# EAGLE design 2020_IST_Respirator_v1.1 (EAGLE 7.7.0)
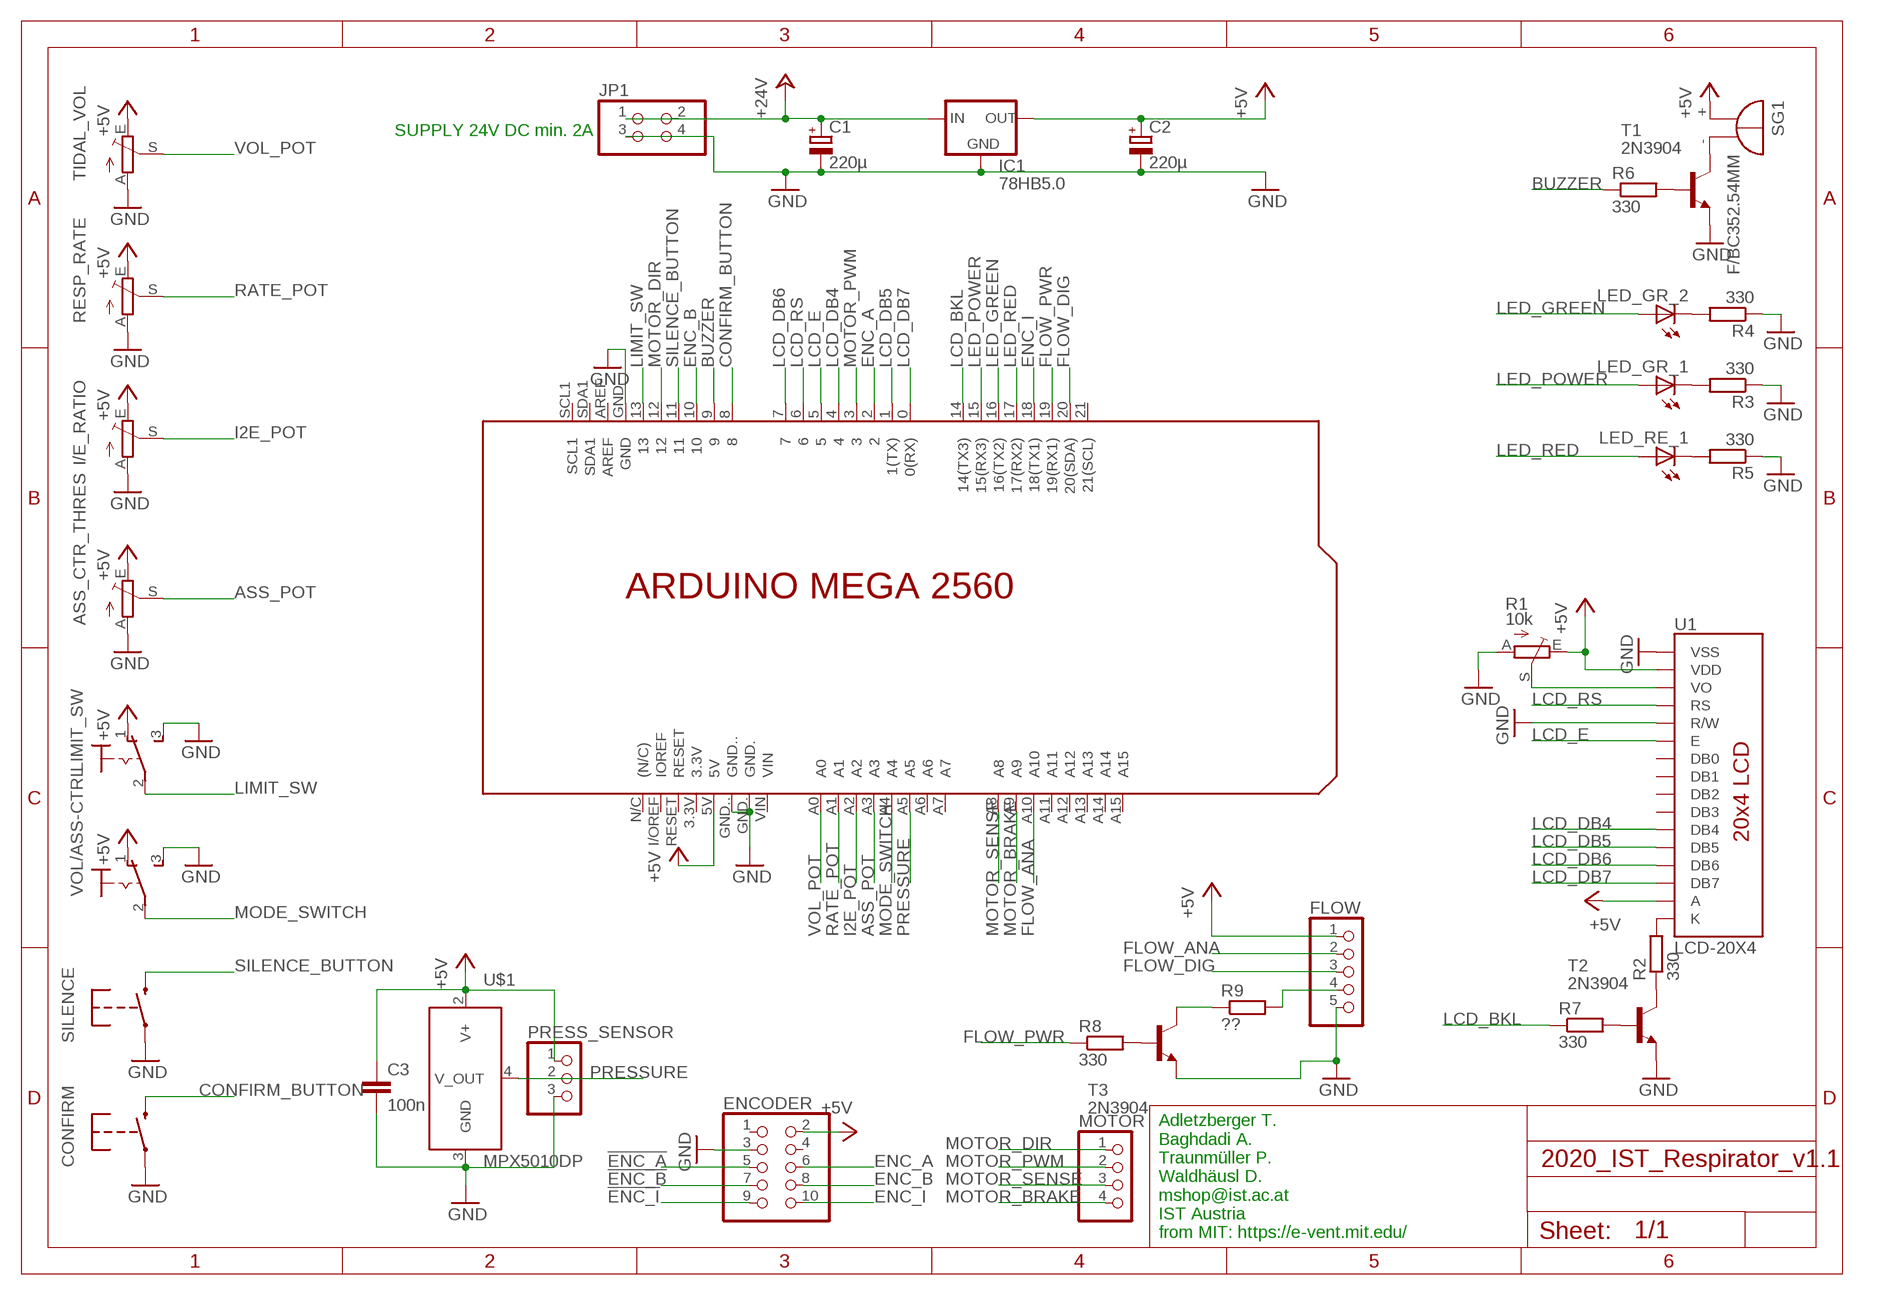
[diagram p0: schematic, sheet 1]

## Parts
ASS_CTR_THRES  TRIM_EU-S64W  [S64W]
C1  220µ  CPOL-EUE5-10.5  [E5-10,5]
C2  220µ  CPOL-EUE5-10.5  [E5-10,5]
C3  100n  C-EUC0805  [C0805]
CONFIRM  SWITCH-MOMENTARY-22.54  [TACTILE-2.54MM]
ENCODER  PINHD-2X5  [2X05]
FLOW  PINHD-1X5  [1X05]
I/E_RATIO  TRIM_EU-S64W  [S64W]
IC1  78HB5.0  78XXS  [78XXS]
JP1  PINHD-2X2  [2X02]
LED_GR_1  LED5MM  [LED5MM]
LED_GR_2  LED5MM  [LED5MM]
LED_RE_1  LED5MM  [LED5MM]
LIMIT_SW  320-9162.54MM  [320-916:2.54MM]
MOTOR  PINHD-1X4  [1X04]
PCB1  ARDUINO_MEGA2560_NOTALLPINS  [ARDUINO_MEGA2560_NOTALLPINS]
PRESS_SENSOR  PINHD-1X3  [1X03]
R1  10k  TRIM_EU-S64W  [S64W]
R2  330  R-EU_0207/10  [0207/10]
R3  330  R-EU_0207/10  [0207/10]
R4  330  R-EU_0207/10  [0207/10]
R5  330  R-EU_0207/10  [0207/10]
R6  330  R-EU_0207/10  [0207/10]
R7  330  R-EU_0207/10  [0207/10]
R8  330  R-EU_0207/10  [0207/10]
R9  ??  R-EU_0207/10  [0207/10]
RESP_RATE  TRIM_EU-S64W  [S64W]
SG1  F/BC352.54MM  [F/BC35_2.54MM]
SILENCE  SWITCH-MOMENTARY-22.54  [TACTILE-2.54MM]
T1  2N3904  [TO92]
T2  2N3904  [TO92]
T3  2N3904  [TO92]
TIDAL_VOL  TRIM_EU-S64W  [S64W]
U1  LCD-20X4  [LCD-20X4]
U$1  MPX5010DP  [MPX5010DP_SOP482]
VOL/ASS-CTRL  320-9162.54MM  [320-916:2.54MM]

## Nets
!ENC_A: ENCODER.5
!ENC_B: ENCODER.7
!ENC_I: ENCODER.9
+5V: ASS_CTR_THRES.E C2.+ C3.1 ENCODER.2 FLOW.1 I/E_RATIO.E IC1.OUT LIMIT_SW.1(O) PCB1.5V PRESS_SENSOR.1 R1.E RESP_RATE.E SG1.+ TIDAL_VOL.E U1.2(VDD) U1.15(A) U$1.2(V+) VOL/ASS-CTRL.1(O)
+24V: C1.+ IC1.IN JP1.1 JP1.2
ASS_POT: ASS_CTR_THRES.S PCB1.A3
BUZZER: PCB1.9 R6.1
CONFIRM_BUTTON: CONFIRM.3 PCB1.8
ENC_A: ENCODER.6 PCB1.2
ENC_B: ENCODER.8 PCB1.10
ENC_I: ENCODER.10 PCB1.18(18(TX1))
FLOW_ANA: FLOW.2 PCB1.A10
FLOW_DIG: FLOW.3 PCB1.20(20(SDA))
FLOW_PWR: PCB1.19(19(RX1)) R8.1
GND: ASS_CTR_THRES.A C1.- C2.- C3.2 CONFIRM.1 ENCODER.3 FLOW.5 I/E_RATIO.A IC1.GND JP1.3 JP1.4 LIMIT_SW.3(S) PCB1.GND PCB1.GND. PCB1.GND.. PRESS_SENSOR.3 R1.A R3.1 R4.1 R5.1 RESP_RATE.A SILENCE.1 T1.3(E) T2.3(E) T3.3(E) TIDAL_VOL.A U1.1(VSS) U1.5(R/W) U$1.3(GND) VOL/ASS-CTRL.3(S)
I2E_POT: I/E_RATIO.S PCB1.A2
LCD_BKL: PCB1.14(14(TX3)) R7.1
LCD_DB4: PCB1.4 U1.11(DB4)
LCD_DB5: PCB1.1(1(TX)) U1.12(DB5)
LCD_DB6: PCB1.7 U1.13(DB6)
LCD_DB7: PCB1.0(0(RX)) U1.14(DB7)
LCD_E: PCB1.5 U1.6(E)
LCD_RS: PCB1.6 U1.4(RS)
LED_GREEN: LED_GR_2.A PCB1.16(16(TX2))
LED_POWER: LED_GR_1.A PCB1.15(15(RX3))
LED_RED: LED_RE_1.A PCB1.17(17(RX2))
LIMIT_SW: LIMIT_SW.2(P) PCB1.13
MODE_SWITCH: PCB1.A4 VOL/ASS-CTRL.2(P)
MOTOR_BRAKE: MOTOR.4 PCB1.A9
MOTOR_DIR: MOTOR.1 PCB1.12
MOTOR_PWM: MOTOR.2 PCB1.3
MOTOR_SENSE: MOTOR.3 PCB1.A8
N$1: R8.2 T3.2(B)
N$2: R9.1 T3.1(C)
N$3: FLOW.4 R9.2
N$9: SG1.- T1.1(C)
N$10: R6.2 T1.2(B)
N$34: R2.2 U1.16(K)
N$35: R2.1 T2.1(C)
N$36: R7.2 T2.2(B)
N$37: R1.S U1.3(VO)
N$38: LED_GR_2.K(C) R4.2
N$39: LED_GR_1.K(C) R3.2
N$40: LED_RE_1.K(C) R5.2
PRESSURE: PCB1.A5 PRESS_SENSOR.2 U$1.4(V_OUT)
RATE_POT: PCB1.A1 RESP_RATE.S
SILENCE_BUTTON: PCB1.11 SILENCE.3
VOL_POT: PCB1.A0 TIDAL_VOL.S
Unconnected: ENCODER.1 ENCODER.4 PCB1.3.3V PCB1.21(21(SCL)) PCB1.A6 PCB1.A7 PCB1.A11 PCB1.A12 PCB1.A13 PCB1.A14 PCB1.A15 PCB1.AREF PCB1.I/OREF(IOREF) PCB1.N/C((N/C)) PCB1.RESET PCB1.SCL1 PCB1.SDA1 PCB1.VIN U1.7(DB0) U1.8(DB1) U1.9(DB2) U1.10(DB3)

## Notes on the sheet
- SUPPLY 24V DC min. 2A
- Adletzberger T.
  Baghdadi A.
  Traunmüller P.
  Waldhäusl D.
  mshop@ist.ac.at
  IST Austria 
  from MIT: https://e-vent.mit.edu/

## Library data of the parts
ASS_CTR_THRES I/E_RATIO R1 RESP_RATE TIDAL_VOL = pot:TRIM_EU-: POTENTIOMETER
C1 C2 = rcl:CPOL-EU: POLARIZED CAPACITOR, European symbol
C3 = rcl:C-EU: CAPACITOR, European symbol
CONFIRM SILENCE = SparkFun:SWITCH-MOMENTARY-2
ENCODER = pinhead:PINHD-2X5: PIN HEADER
FLOW = pinhead:PINHD-1X5: PIN HEADER
IC1 = v-reg:78XXS: VOLTAGE REGULATOR
JP1 = pinhead:PINHD-2X2: PIN HEADER
LED_GR_1 LED_GR_2 LED_RE_1 = led:LED: LED OSRAM: - CHIPLED LG R971, LG N971, LY N971, LG Q971, LY Q971, LO R971, LY R971 LH N974, LH R974 LS Q976, LO Q976, LY Q976 LO Q996 - Hyper CHIPLED LW Q18S LB Q993, LB Q99A, LB R99A - SideLED LS A670, LO A670, LY A670, LG A670, LP A670 LB A673, LV A673, LT A673, LW A673 LH A674 LY A675 LS A676, LA A676, LO A676, LY A676, LW A676 LS A679, LY A679, LG A679 - Hyper Micro SIDELED® LS Y876, LA Y876, LO Y876, LY Y876 LT Y87S - SmartLED LW L88C, LW L88S LB L89C, LB L89S, LG L890 LS L89K, LO L89K, LY L89K LS L896, LA L896, LO L896, LY L896 - TOPLED LS T670, LO T670, LY T670, LG T670, LP T670 LSG T670, LSP T670, LSY T670, LOP T670, LYG T670 LG T671, LOG T671, LSG T671 LB T673, LV T673, LT T673, LW T673 LH T674 LS T676, LA T676, LO T676, LY T676, LB T676, LH T676, LSB T676, LW T676 LB T67C, LV T67C, LT T67C, LS T67K, LO T67K, LY T67K, LW E67C LS E67B, LA E67B, LO E67B, LY E67B, LB E67C, LV E67C, LT E67C LW T67C LS T679, LY T679, LG T679 LS T770, LO T770, LY T770, LG T770, LP T770 LB T773, LV T773, LT T773, LW T773 LH T774 LS E675, LA E675, LY E675, LS T675 LS T776, LA T776, LO T776, LY T776, LB T776 LHGB T686 LT T68C, LB T68C - Hyper Mini TOPLED® LB M676 - Mini TOPLED Santana® LG M470 LS M47K, LO M47K, LY M47K Source: http://www.osram.convergy.de LUXEON: - LUMILED® LXK2-PW12-R00, LXK2-PW12-S00, LXK2-PW14-U00, LXK2-PW14-V00 LXK2-PM12-R00, LXK2-PM12-S00, LXK2-PM14-U00 LXK2-PE12-Q00, LXK2-PE12-R00, LXK2-PE12-S00, LXK2-PE14-T00, LXK2-PE14-U00 LXK2-PB12-K00, LXK2-PB12-L00, LXK2-PB12-M00, LXK2-PB14-N00, LXK2-PB14-P00, LXK2-PB14-Q00 LXK2-PR12-L00, LXK2-PR12-M00, LXK2-PR14-Q00, LXK2-PR14-R00 LXK2-PD12-Q00, LXK2-PD12-R00, LXK2-PD12-S00 LXK2-PH12-R00, LXK2-PH12-S00 LXK2-PL12-P00, LXK2-PL12-Q00, LXK2-PL12-R00 Source: www.luxeon.com KINGBRIGHT: KA-3528ASYC Source: www.kingbright.com
LIMIT_SW VOL/ASS-CTRL = switch:320-916: TOGGLE SWITCH distributor RS Components
MOTOR = pinhead:PINHD-1X4: PIN HEADER
PCB1 = E14_Arduino_revB:ARDUINO_MEGA2560_NOTALLPINS: Device for representing an Arduino Mega 2560 board with a footprint in an EAGLE design. Created by Dave Young for Element14. More EAGLE documentation at: http://www.element14.com/community/community/knode/cadsoft_eagle
PRESS_SENSOR = pinhead:PINHD-1X3: PIN HEADER
R2-R9 = rcl:R-EU_: RESISTOR, European symbol
SG1 = buzzer:F/BC35: BUZZER Source: Spoerle
T1-T3 = transistor:2N3904: NPN TRANSISTOR
U1 = SparkFun:LCD-20X4
U$1 = SparkFun:MPX5010DP: MPX5010 Pressure Sensor Differential/Gauge Pressure Sensors up to 10 kPa, NXP MEMS-based low-pressure differential/gauge sensors measure the difference in pressure between sources when pressure is applied to both sides of the sensor (differential) and atmospheric pressure (gauged). Pressure Sensors, NXP RS Stock No. 922-7409 Mfr. Part No. MPXV5010DP

## Board
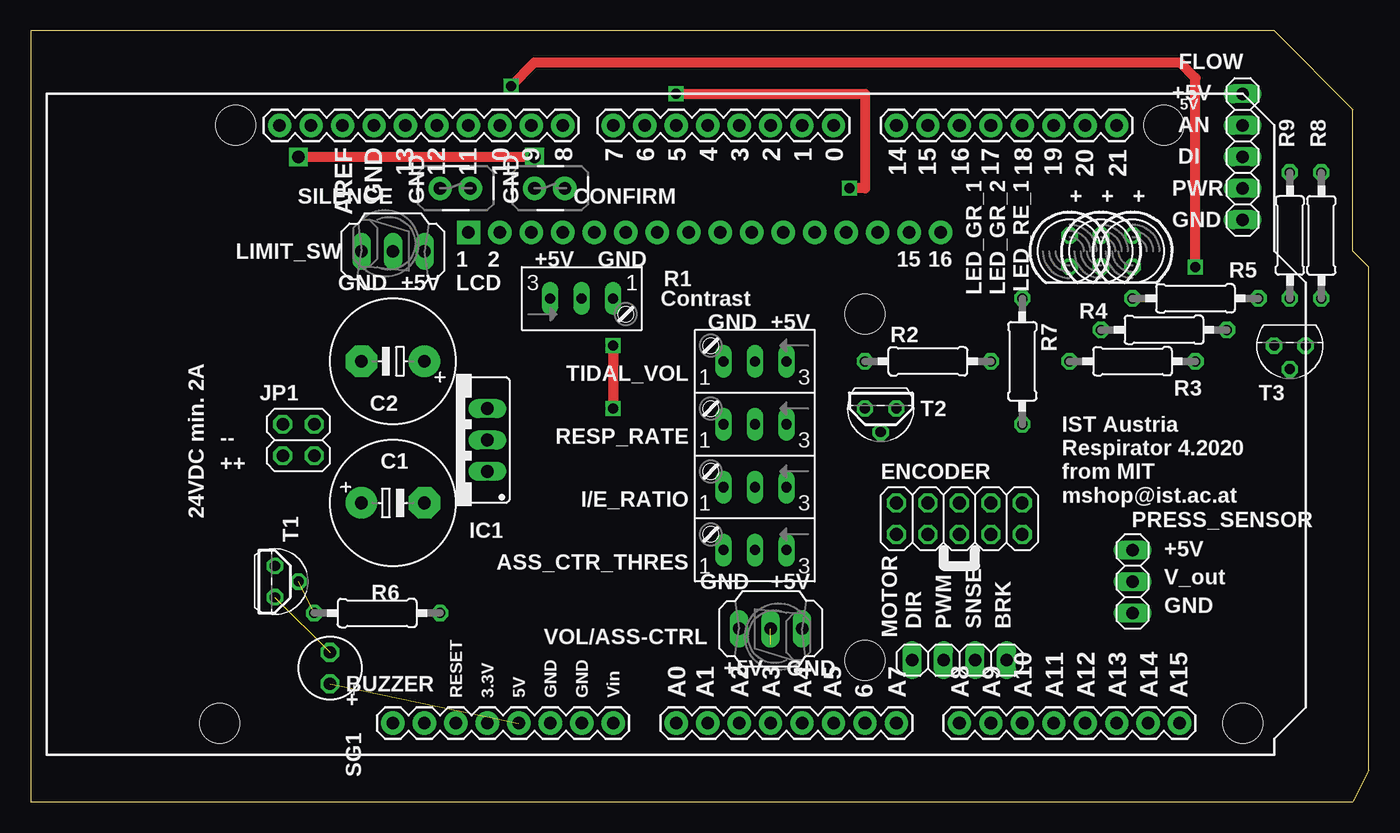
[diagram p1: board, top side]
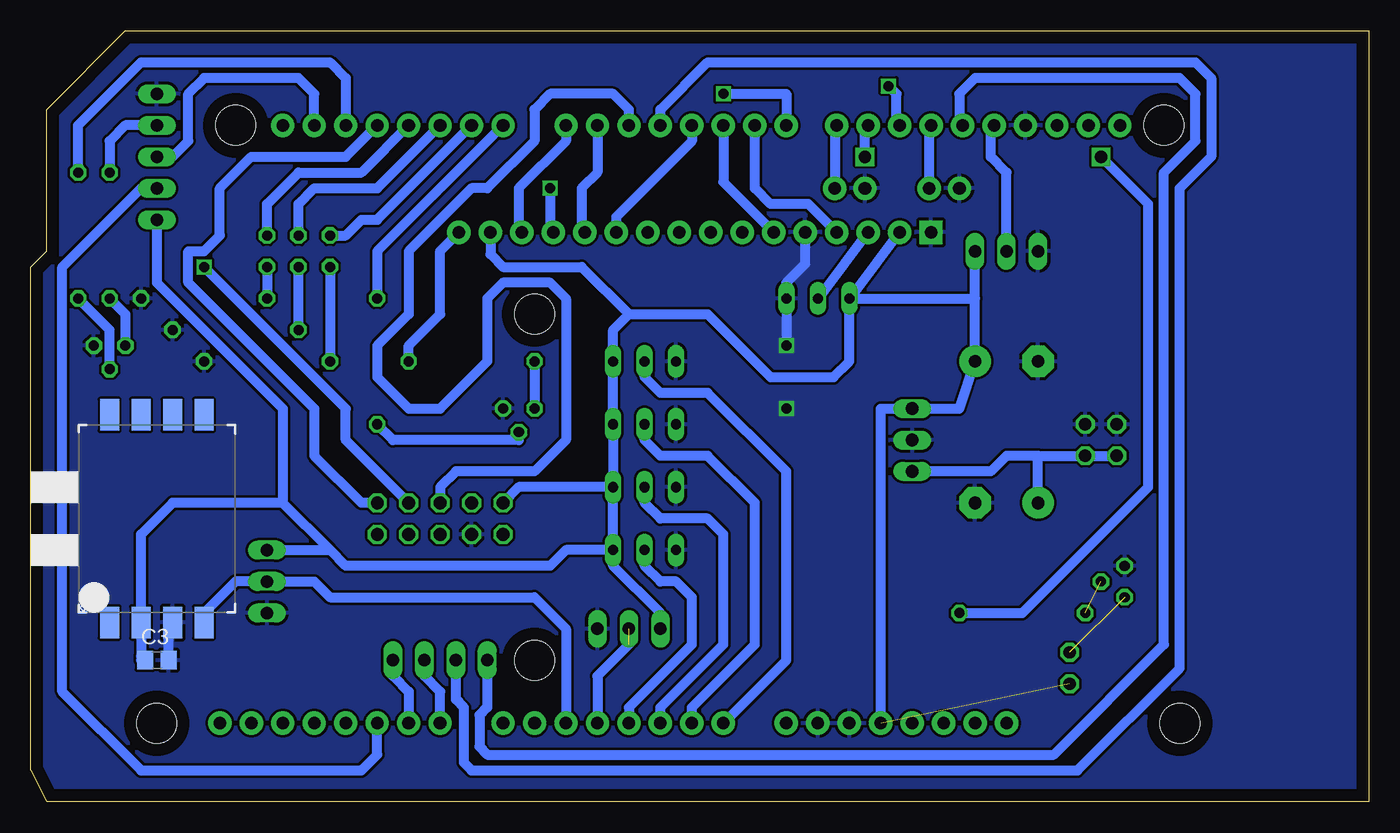
[diagram p2: board, bottom side, seen from below]

Size 107.95 x 62.23 mm. Coordinates in mm from the lower left corner, seen from the top.
Outline: 0,0 106.68,0 107.95,2.54 107.95,43.18 106.68,44.45 106.68,55.88 100.33,62.23 0,62.23 0,0
Copper layers (1*16): Top 0.035mm / dielectric 1.5mm / Bottom 0.035mm
Design rules "default": minimum track width 10mil, minimum drill 24mil, track to track 8mil, track to pad 8mil, pad to pad 8mil, via to via 8mil, smd to smd 8mil, copper to edge 40mil, drill to drill 8mil, minimum pad ring 10mil, minimum via ring 8mil, stop-mask expansion 4mil, vias tented up to drill 0mil, thermal gap 10mil

### Footprints (pad centres in the part's own frame; a part is rotated, then mirrored left to right if it is on the bottom)
S64W = drill 0.813 long: A 2.54,1.27; E -2.54,1.27; S 0,1.27
E5-10,5 = drill 1.016 pad 2.54: + -2.54,0 | drill 1.016 pad 2.54 octagon: - 2.54,0
C0805 = smd 1.3 x 1.5: 1 -0.95,0; 2 0.95,0
TACTILE-2.54MM = drill 1.016 pad 1.88: 1 0,1.27; 3 0,-1.17
2X05 = drill 1.016 octagon: 1 -5.08,-1.27; 2 -5.08,1.27; 3 -2.54,-1.27; 4 -2.54,1.27; 5 0,-1.27; 6 0,1.27; 7 2.54,-1.27; 8 2.54,1.27; 9 5.08,-1.27; 10 5.08,1.27
1X05 = drill 1.016 long: 1 -5.08,0; 2 -2.54,0; 3 0,0; 4 2.54,0; 5 5.08,0
78XXS = drill 1.016 long: GND 0,-2.54; IN -2.54,-2.54; OUT 2.54,-2.54
2X02 = drill 1.016 octagon: 1 -1.27,-1.27; 2 -1.27,1.27; 3 1.27,-1.27; 4 1.27,1.27
LED5MM = drill 0.813 octagon: A -1.27,0; K 1.27,0
320-916:2.54MM = drill 1 long: 1 0,2.54; 2 0,0; 3 0,-2.54
1X04 = drill 1.016 long: 1 -3.81,0; 2 -1.27,0; 3 1.27,0; 4 3.81,0
ARDUINO_MEGA2560_NOTALLPINS = drill 1.016 pad 1.88: 0 63.5,50.8; 1 60.96,50.8; 2 58.42,50.8; 3 55.88,50.8; 3.3V 35.56,2.54; 4 53.34,50.8; 5 50.8,50.8; 5V 38.1,2.54; 6 48.26,50.8; 7 45.72,50.8; 8 41.656,50.8; 9 39.116,50.8; 10 36.576,50.8; 11 34.036,50.8; 12 31.496,50.8; 13 28.956,50.8; 14 68.58,50.8; 15 71.12,50.8; 16 73.66,50.8; 17 76.2,50.8; 18 78.74,50.8; 19 81.28,50.8; 20 83.82,50.8; 21 86.36,50.8; A0 50.8,2.54; A1 53.34,2.54; A2 55.88,2.54; A3 58.42,2.54; A4 60.96,2.54; A5 63.5,2.54; A6 66.04,2.54; A7 68.58,2.54; A8 73.66,2.54; A9 76.2,2.54; A10 78.74,2.54; A11 81.28,2.54; A12 83.82,2.54; A13 86.36,2.54; A14 88.9,2.54; A15 91.44,2.54; AREF 23.876,50.8; GND 26.416,50.8; GND. 43.18,2.54; GND.. 40.64,2.54; I/OREF 30.48,2.54; N/C 27.94,2.54; RESET 33.02,2.54; SCL1 18.796,50.8; SDA1 21.336,50.8; VIN 45.72,2.54 | hole 3.2: 15.24,50.8; 13.97,2.54; 66.04,35.56; 66.04,7.62; 90.17,50.8; 96.52,2.54
1X03 = drill 1.016 long: 1 -2.54,0; 2 0,0; 3 2.54,0
0207/10 = drill 0.813 octagon: 1 -5.08,0; 2 5.08,0
F/BC35_2.54MM = drill 1 octagon: + 1.27,0; - -1.27,0
TO92 = drill 0.813 octagon: 1 1.27,0; 2 0,1.905; 3 -1.27,0
LCD-20X4 = drill 1.016 pad 1.88 square: 1 -19.3,0.26 | drill 1.016 pad 1.88: 2 -16.76,0.26; 3 -14.22,0.26; 4 -11.68,0.26; 5 -9.14,0.26; 6 -6.6,0.26; 7 -4.06,0.26; 8 -1.52,0.26; 9 1.02,0.26; 10 3.56,0.26; 11 6.1,0.26; 12 8.64,0.26; 13 11.18,0.26; 14 13.72,0.26; 15 16.26,0.26; 16 18.8,0.26
MPX5010DP_SOP482 = smd 2.54 x 1.524: 1 -8.382,3.81; 2 -8.382,1.27; 3 -8.382,-1.27; 4 -8.382,-3.81; 5 8.382,-3.81; 6 8.382,-1.27; 7 8.382,1.27; 8 8.382,3.81

### Placement (x,y rotation side)
ASS_CTR_THRES  58.42,21.59 180 top
C1  29.21,24.13 0 top
C2  29.21,35.56 180 top
C3  97.79,11.43 0 bottom
CONFIRM  41.91,49.53 90 top
ENCODER  74.93,22.86 0 top
FLOW  97.79,52.07 90 top
I/E_RATIO  58.42,26.67 180 top
IC1  34.29,29.21 90 top
JP1  21.59,29.21 90 top
LED_GR_1  83.82,44.45 270 top
LED_GR_2  86.36,44.45 270 top
LED_RE_1  88.9,44.45 270 top
LIMIT_SW  29.21,44.45 270 top
MOTOR  74.93,11.43 0 top
PCB1  1.27,3.81 0 top
PRESS_SENSOR  88.9,17.78 270 top
R1  44.45,39.37 0 top
R2  72.39,35.56 0 top
R3  88.9,35.56 180 top
R4  91.44,38.1 180 top
R5  93.98,40.64 180 top
R6  27.94,15.24 180 top
R7  80.01,35.56 270 top
R8  104.14,45.72 270 top
R9  101.6,45.72 90 top
RESP_RATE  58.42,31.75 180 top
SG1  24.13,10.79 270 top
SILENCE  34.29,49.53 90 top
T1  19.68,17.78 270 top
T2  68.58,31.75 180 top
T3  101.6,36.83 180 top
TIDAL_VOL  58.42,36.83 180 top
U1  54.61,45.72 0 top
U$1  97.79,22.86 90 bottom
VOL/ASS-CTRL  59.69,13.97 90 top

### Tracks (layer width: path | path; a pad name or v marks a point on that pad's centre or on a via)
+5V  (1 unrouted)
  Bottom 0.813: 31.75,40.64 C2.+ 33.02,31.75 IC1.OUT 39.37,31.75 PCB1.5V | 31.75,40.64 LIMIT_SW.1 | ASS_CTR_THRES.E I/E_RATIO.E | I/E_RATIO.E RESP_RATE.E TIDAL_VOL.E 60.96,38.1 59.69,39.37 | U1.2 41.66,40.89 R1.E | R1.E 31.75,40.64 | 59.69,39.37 53.34,39.37 48.26,34.29 43.18,34.29 41.91,35.56 R1.E | I/E_RATIO.E 68.58,25.4 ENCODER.2 | 99.06,11.43 C3.1 99.06,11.75 U$1.2 99.06,21.59 96.52,24.13 87.63,24.13 | VOL/ASS-CTRL.1 57.15,15.24 60.96,19.05 ASS_CTR_THRES.E | ASS_CTR_THRES.E 64.77,20.32 66.04,19.05 82.55,19.05 83.82,20.32 | 83.82,20.32 87.63,24.13 | U1.15 70.87,44.2 69.85,43.18 63.5,43.18 59.69,39.37 | PRESS_SENSOR.1 83.82,20.32 | FLOW.1 97.79,41.91 87.63,31.75 87.63,24.13
+24V
  Bottom 0.813: JP1.2 JP1.1 26.67,27.94 | C1.+ 26.67,27.94 | 26.67,27.94 29.21,27.94 30.48,26.67 IC1.IN
ASS_POT
  Bottom 0.813: ASS_CTR_THRES.S 58.42,19.05 57.15,17.78 55.88,17.78 54.61,16.51 54.61,12.7 59.69,7.62 PCB1.A3
BUZZER  (via drill 1)
  Top 0.813: v21.59,52.07 v40.64,52.07
  Bottom 0.813: R6.1 27.94,15.24 17.78,25.4 17.78,48.26 v21.59,52.07 | v40.64,52.07 40.64,54.36 PCB1.9
CONFIRM_BUTTON
  Bottom 0.813: PCB1.8 43.08,54.61 CONFIRM.3
ENC_A
  Bottom 0.813: PCB1.2 59.69,55.88 60.96,57.15 66.04,57.15 67.31,55.88 67.31,53.34 71.12,49.53 72.39,49.53 77.47,44.45 77.47,39.37 80.01,36.83 80.01,34.29 77.47,31.75 74.93,31.75 71.12,35.56 71.12,40.64 69.85,41.91 66.04,41.91 64.77,40.64 64.77,29.21 67.31,26.67 73.66,26.67 74.93,25.4 ENCODER.6
ENC_B  (via drill 0.8)
  Top 0.813: v93.98,43.18 93.98,58.42 92.71,59.69 40.64,59.69 v38.73,57.78
  Bottom 0.813: ENCODER.8 82.55,29.21 82.55,31.75 v93.98,43.18 | PCB1.10 38.1,54.86 38.1,57.15 v38.73,57.78
ENC_I
  Bottom 0.813: ENCODER.10 81.28,24.13 85.09,27.94 85.09,31.75 95.25,41.91 95.25,44.45 93.98,44.45 92.71,45.72 92.71,49.53 90.17,52.07 82.55,52.07 PCB1.18
FLOW_ANA
  Bottom 0.813: FLOW.2 99.06,49.53 105.41,43.18 105.41,8.89 99.06,2.54 81.28,2.54 80.01,3.81 PCB1.A10
FLOW_DIG
  Bottom 0.813: FLOW.3 96.52,52.07 95.25,53.34 95.25,57.15 93.98,58.42 86.36,58.42 85.09,57.15 PCB1.20
FLOW_PWR
  Bottom 0.813: R8.1 104.14,54.61 99.06,59.69 83.82,59.69 82.55,58.42 PCB1.19
GND  (via drill 0.8)
  Top 0.813: v46.99,36.83 v46.99,31.75
  Bottom 0.813: C3.2 96.84,14.16 U$1.3 | U1.5 45.47,43.43 46.99,41.91 R1.A v46.99,36.83
  pour Bottom: -2.54,64.77 -2.54,-1.27 111.76,-1.27 113.03,0 113.03,55.88 105.41,63.5 -1.27,63.5
I2E_POT
  Bottom 0.813: PCB1.A2 57.15,7.62 52.07,12.7 52.07,21.59 53.34,22.86 57.15,22.86 58.42,24.13 I/E_RATIO.S
LCD_BKL
  Bottom 0.813: R7.1 80.01,44.45 PCB1.14
LCD_DB4
  Bottom 0.813: PCB1.4 54.61,53.34 60.71,47.24 U1.11
LCD_DB5
  Bottom 0.813: PCB1.1 62.23,50.8 63.5,49.53 63.5,46.23 U1.12
LCD_DB6  (via drill 0.8)
  Top 0.813: v66.04,49.53 67.31,49.53 67.31,57.15 v52.07,57.15
  Bottom 0.813: v66.04,49.53 66.04,46.23 U1.13 | PCB1.7 46.99,57.15 v52.07,57.15
LCD_DB7
  Bottom 0.813: PCB1.0 64.77,53.34 68.58,49.53 68.58,46.23 U1.14
LCD_E
  Bottom 0.813: PCB1.5 52.07,50.04 U1.6
LCD_RS
  Bottom 0.813: PCB1.6 49.53,49.53 48.26,48.26 45.21,48.26 U1.4
LED_GREEN
  Bottom 0.813: PCB1.16 80.01,49.53 85.09,49.53 86.36,48.26 LED_GR_2.A
LED_POWER
  Bottom 0.813: PCB1.15 80.01,46.99 81.28,46.99 82.55,45.72 LED_GR_1.A
LED_RED
  Bottom 0.813: PCB1.17 81.28,50.8 86.36,50.8 88.9,48.26 LED_RE_1.A
LIMIT_SW
  Bottom 0.813: 30.48,54.61 PCB1.13 30.48,54.36 30.48,52.07 29.21,50.8 LIMIT_SW.2
MODE_SWITCH  (1 unrouted)
  Bottom 0.813: 59.69,12.7 62.23,10.16 PCB1.A4
MOTOR_BRAKE
  Bottom 0.813: MOTOR.4 78.74,10.16 77.47,8.89 PCB1.A9
MOTOR_DIR
  Bottom 0.813: PCB1.12 33.02,54.86 33.02,57.15 31.75,58.42 15.24,58.42 13.97,57.15 13.97,53.34 16.51,50.8 16.51,12.7 25.4,3.81 71.12,3.81 71.75,4.45 71.75,6.99 71.12,7.62 MOTOR.1
MOTOR_PWM
  Bottom 0.813: PCB1.3 57.15,55.88 53.34,59.69 13.97,59.69 12.7,58.42 12.7,52.07 15.24,49.53 15.24,10.79 23.5,2.54 72.39,2.54 73.03,3.17 73.03,7.62 73.66,8.26 MOTOR.2
MOTOR_SENSE
  Bottom 0.813: PCB1.A8 74.93,8.89 76.2,10.16 MOTOR.3
N$1
  Bottom 0.813: T3.2 101.6,38.1 R8.2
N$2
  Bottom 0.813: R9.1 100.33,39.37 T3.1
N$3
  Bottom 0.813: FLOW.4 100.33,54.61 101.6,53.34 R9.2
N$9  (1 unrouted)
N$10  (1 unrouted)
N$34
  Bottom 0.813: R2.2 77.47,36.83 74.93,39.37 74.93,44.46 U1.16
N$35
  Bottom 0.813: R2.1 T2.1
N$36
  Bottom 0.813: T2.2 68.58,29.21 78.74,29.21 R7.2
N$37
  Bottom 0.813: U1.3 44.2,40.89 R1.S
N$38
  Bottom 0.813: R4.2 LED_GR_2.K
N$39
  Bottom 0.813: LED_GR_1.K R3.2
N$40
  Bottom 0.813: LED_RE_1.K R5.2
PRESSURE
  Bottom 0.813: 93.98,13.97 U$1.4 93.98,15.24 91.44,17.78 PRESS_SENSOR.2 85.09,17.78 83.82,16.51 67.31,16.51 64.77,13.97 PCB1.A5
RATE_POT
  Bottom 0.813: PCB1.A1 54.61,7.62 49.53,12.7 49.53,24.13 53.34,27.94 57.15,27.94 58.42,29.21 RESP_RATE.S
SILENCE_BUTTON
  Bottom 0.813: PCB1.11 35.46,54.61 SILENCE.3
VOL_POT
  Bottom 0.813: PCB1.A0 46.99,11.43 46.99,26.67 53.34,33.02 57.15,33.02 58.42,34.29 TIDAL_VOL.S

### Text on the board
tNames: GND | GND | + | + | + | +5V / AN / DI / PWR / GND | 1 | 2 | +5V | GND | 15 | 16 | GND | +5V | LCD | Contrast | GND | +5V | -- / ++ | IST Austria / Respirator 4.2020 / from MIT / mshop@ist.ac.at | 24VDC min. 2A | GND | +5V | +5V / V_out / GND | DIR / PWM / SNSE / BRK | +5V | GND | BUZZER | +